# Altium schematic sheet projectthermodigi.SchDoc
size A4; SheetNumber: 1; SheetTotal: 2
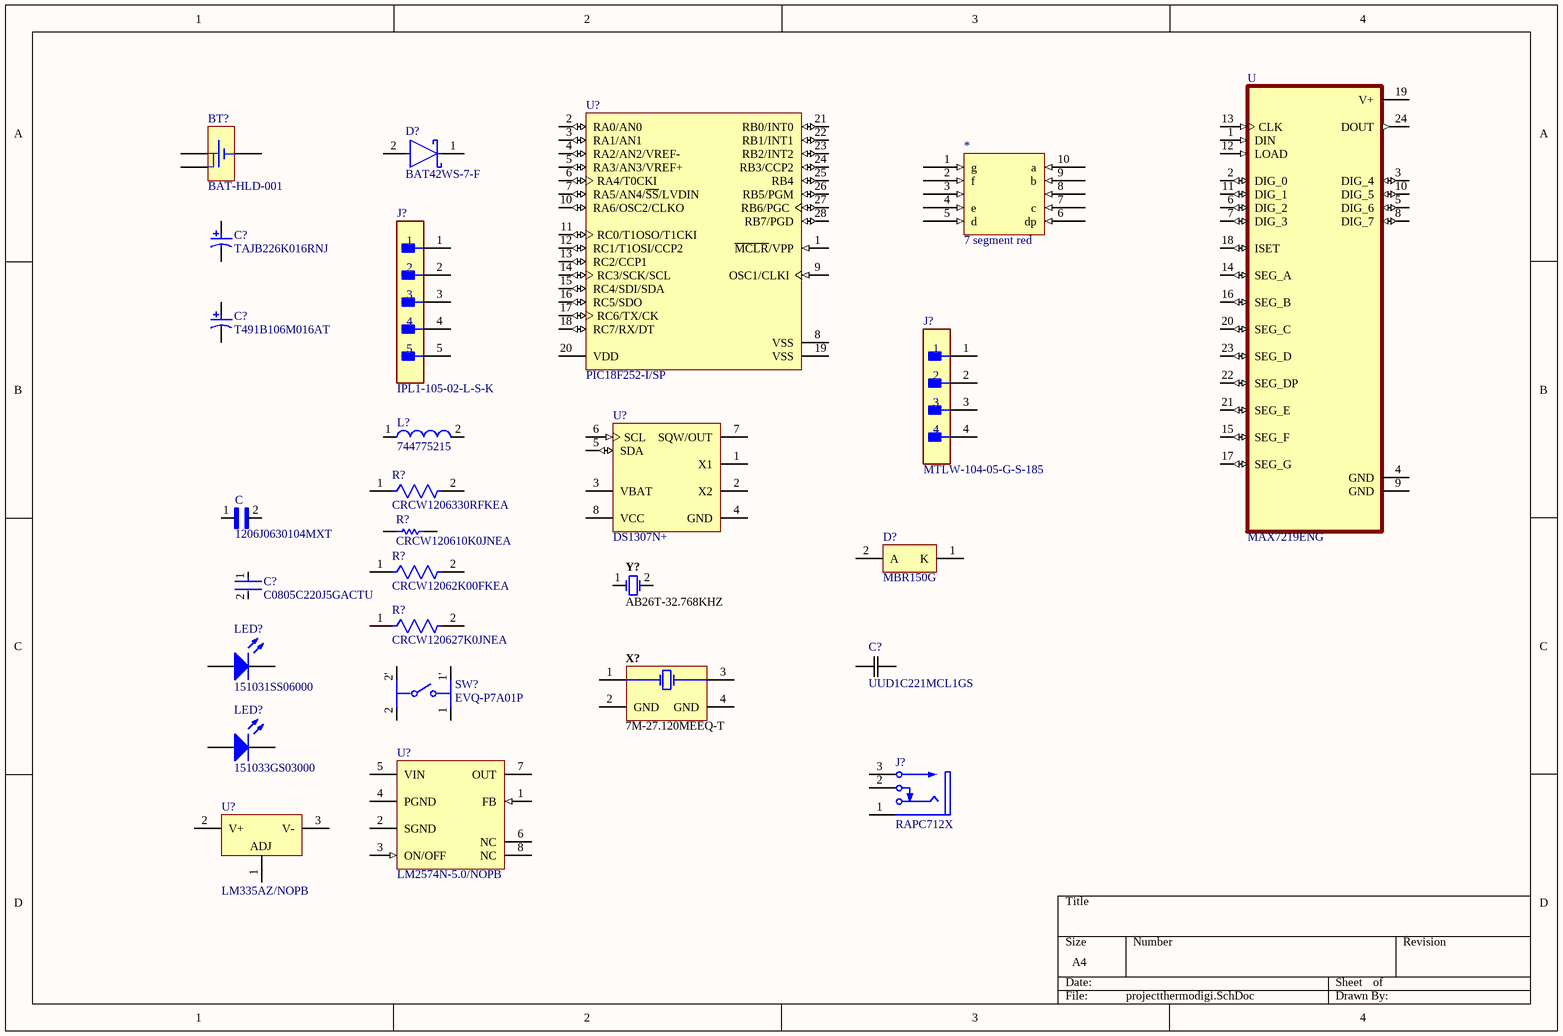
[diagram p0: projectthermodigi.SchDoc]

## Parts
(Parts that share a designator on the sheet are numbered #1, #2 ... from top to bottom, then left to right.)
*  7 segment red  [7 segment]
BT?  BAT-HLD-001  [BATHLD-001]
C  1206J0630104MXT  [CAPC3216X160N]
C?#1  TAJB226K016RNJ  [AVX-TAJ-B-2_M]
C?#2  T491B106M016AT  [KEMT-T491-B_L]
C?#3  C0805C220J5GACTU  [FP-C0805C-DN-MFG]
C?#4  UUD1C221MCL1GS  [U2-K_NCH]
D?#1  BAT42WS-7-F  [FP-SOD323-MFG]
D?#2  MBR150G  [ONSC-AXIAL_LEAD-2-59-10_P]
J?#1  IPL1-105-02-L-S-K  [FP-IPL1-105-02-L-S-K-0]
J?#2  MTLW-104-05-G-S-185  [FP-MTLW-104-05-G-S-185-MFG]
J?#3  RAPC712X  [SWITCH-RAPC712X-3_V]
L?  744775215  [WE-PD2-L]
LED?#1  151031SS06000  [Type 3mm]
LED?#2  151033GS03000  [Type 3mm]
R?#1  CRCW1206330RFKEA  [FP-CRCW1206-e3-IPC_A]
R?#2  CRCW120610K0JNEA  [RESC3216X60X45ML10T20]
R?#3  CRCW12062K00FKEA  [FP-CRCW1206-e3-IPC_A]
R?#4  CRCW120627K0JNEA  [FP-CRCW1206-e3-MFG]
SW?  EVQ-P7A01P  [FP-EVQ-P7A01P-MFG]
U  MAX7219ENG  [DIP794W47P254L3213H457Q24]
U?#1  PIC18F252-I/SP  [MCHP-SPDIP-SP28]
U?#2  DS1307N+  [P8+2]
U?#3  LM2574N-5.0/NOPB  [P0008A]
U?#4  LM335AZ/NOPB  [LP0003A]
X?  7M-27.120MEEQ-T  [TXC-7M-4_V]
Y?  AB26T-32.768KHZ  [ABRA-AB26T]

## Nets

Not connected (* = marked no-connect by the designer): * 1(g) 2(f) 3 4(e) 5(d) 6(dp) 7(c) 8 9(b) 10(a); BT? 1(-) 2(+) 3(+); C 1 2; C?#1 1 2; C?#2 1 2; C?#3 1 2; C?#4 1 2; D?#1 1(C) 2(A); D?#2 1(K) 2(A); J?#1 1 2 3 4 5; J?#2 1 2 3 4; J?#3 1 2 3; L? 1 2; LED?#1 1(K) 2(A); LED?#2 1(K) 2(A); R?#1 1 2; R?#2 1 2; R?#3 1 2; R?#4 1 2; SW? 1 1' 2 2'; U 1(DIN) 2(DIG_0) 3(DIG_4) 4(GND) 5(DIG_6) 6(DIG_2) 7(DIG_3) 8(DIG_7) 9(GND) 10(DIG_5) 11(DIG_1) 12(LOAD) 13(CLK) 14(SEG_A) 15(SEG_F) 16(SEG_B) 17(SEG_G) 18(ISET) 19(V+) 20(SEG_C) 21(SEG_E) 22(SEG_DP) 23(SEG_D) 24(DOUT); U?#1 1(~{MCLR}/VPP) 2(RA0/AN0) 3(RA1/AN1) 4(RA2/AN2/VREF-) 5(RA3/AN3/VREF+) 6(RA4/T0CKI) 7(RA5/AN4/~{SS}/LVDIN) 8(VSS) 9(OSC1/CLKI) 10(RA6/OSC2/CLKO) 11(RC0/T1OSO/T1CKI) 12(RC1/T1OSI/CCP2) 13(RC2/CCP1) 14(RC3/SCK/SCL) 15(RC4/SDI/SDA) 16(RC5/SDO) 17(RC6/TX/CK) 18(RC7/RX/DT) 19(VSS) 20(VDD) 21(RB0/INT0) 22(RB1/INT1) 23(RB2/INT2) 24(RB3/CCP2) 25(RB4) 26(RB5/PGM) 27(RB6/PGC) 28(RB7/PGD); U?#2 1(X1) 2(X2) 3(VBAT) 4(GND) 5(SDA) 6(SCL) 7(SQW/OUT) 8(VCC); U?#3 1(FB) 2(SGND) 3(ON/OFF) 4(PGND) 5(VIN) 6(NC) 7(OUT) 8(NC); U?#4 1(ADJ) 2(V+) 3(V-); X? 1(X1) 2(GND) 3(X2) 4(GND); Y? 1 2

## Library data of the parts
BT? = CMP-0168-00043-1: 20mm Coin Cell Battery Holder; PCB_Layout: Complies with manufacturer's recommendation.; DatasheetVersion: rev1.0, Dec-2007; PackageVersion: rev1.0, Dec-2007; PackageReference: BATHLD-001; PackageDescription: Low Profile SM Battery Holder, 20mm Lithium Cell, 21.1 x 15.3 x 4.2 mm Body
C = 1206J0630104MXT: 0.1ÂµF Â±20% 63V Ceramic Capacitor X7R (2R1) 1206 (3216 Metric); MF: Knowles Syfer; MP: 1206J0630104MXT; SnapEDA_Link: https://www.snapeda.com/parts/1206J0630104MXT/Knowles%20Syfer/view-part/4314687/?ref=snap; DigiKey-Purchase-URL: https://snapeda.com/shop?store=DigiKey&id=4314687; Mouser-Purchase-URL: https://snapeda.com/shop?store=Mouser&id=4314687; Value: *; Digi-Key_Part_Number: 1608-1392-1-ND; Package: 3216 Knowles Syfer
C?#1 = CMP-2100-03689-1: Standard Tantalum, 22 uF, +/- 10%, 16 V, -55 to 125 degC, 2-Pin SMD (1210), RoHS, Tape and Reel; Manufacturer: AVX; Leakage Current: 3.5uA; Dissipation Factor: 6%; Voltage Rating (DC): 16V; Capacitance: 22uF; ESR (Equivalent Series Resistance): 2.3Ohm; Polarity: Polar; Package Quantity: 1; Tolerance: 10%; Number of Pins: 2; Manufacturer URL: http://www.avx.com/; Height - Seated (Max): 0.083inch; Case Code (Imperial): 1210; Package Reference: TAJ-B-2; Height: 1.9mm; Depth: 2.8mm; Packaging: TapeandReel; Termination: SMD/SMT; Case/Package: 1210; Lead Free: LeadFree; Min Operating Temperature: -55degC; RoHSCompliant: True; Dielectric Material: Tantalum; Case Code (Metric): 3528; Width: 2.8mm; Datasheet URL: http://datasheets.avx.com/TAJ.pdf; Radiation Hardening: No; Package Description: 2-Pin Surface Mount Device, Body 3.5 x 2.85 mm; Length: 3.5mm; Voltage Rating: 16V; Datasheet Version: 42401.0; Max Operating Temperature: 125degC; REACH SVHC: NoSVHC; Voltage: 16V
C?#2 = CMP-2000-07192-1: Tantalum Surface Mount Capacitor, 10 uF, +/- 20%, 16 V, -55 to 125 degC, 2-Pin SMD, RoHS, Tape and Reel; Manufacturer: Kemet; DF: 6%; Product Diameter (mm): NotRequiredmm; ESR: 2.8ohm; Capacitance: 10000000pF; Insulation: NotRequired; Rad Hardened: No; Polarity: Polar; Case Style: Molded; Product Depth (mm): 2.8mm; Product Length (mm): 3.5mm; Voltage: 16VDC; DCL: 1.6uA; Product Height (mm): 1.9mm; Mounting Technology: SurfaceMount; Package Reference: T491-B; Datasheet URL: http://www.kemet.com/Lists/ProductCatalog/Attachments/254/KEM_T2005_T491.pdf; Construction: SMTChip; Package / Case: 3528-21; Length W/Weld: NotRequiredmm; Seated Plane Height: NotRequiredmm; Datasheet Version: 06/2016; Seal: NotRequired; Mounting Style: SurfaceMount; Failure Rate: NotRequired; Operating Temp Range: -55Cto125C; Manufacturer URL: http://www.kemet.com/; Tolerance (+ or -): 20%; Case Code: B; Packaging: TapeandReel; Lead Spacing (nom): NotRequiredmm; Length W/Weld (max): NotRequiredmm; Package Description: 2-Pin Surface Mount Device, Body 3.5 x 2.8 mm; Wire Form: NotRequired
C?#3 = CMP-2007-00048-2: Capacitor; Ceramic; Cap; 22.0pF; Tol 5%; SMT; Vol-Rtg 50V; C0G; Tape and Reel; Manufacturer: KEMET; Temperature Coefficient: 30ppm/°C; Capacitance: 22 pF; Value: 22 pF; Tolerance: 0.05; Device Class L1: Passive Components; Mouser Description: Multilayer Ceramic Capacitors MLCC - SMD/SMT 50volts 22pF C0G 5%; Temperature Range Low: -55°C; Automotive: No; Voltage Rating: 50 V; Material: Ceramic; Category: Cap; Height: 0.88mm; Temperature Range High: +125°C; Digikey Description: Capacitor; Ceramic; Cap; 22.0pF; Tol 5%; SMT; Vol-Rtg 50V; C0G; Tape and Reel; Octopart: https://octopart.com/c0805c220j5gactu-kemet-145470; ComponentLink2Description: Datasheet; Device Class L2: Capacitors; Ipc Land Pattern Name: CAPC200125X78; RoHS: TRUE; ComponentLink2URL: https://content.kemet.com/datasheets/KEM_C1003_C0G_SMD.pdf; Temperature: -55°C to +125°C; Device Class L3: Ceramic Capacitors; Lead Free: Yes; Manufacturer Part Number: C0805C220J5GACTU; Temperature Characteristic: C0G; Package: C0805C-DN
C?#4 = UUD1C221MCL1GS: No Description Available; Vendor: Nichicon; Built_By: EMA_UL_Team; SourceLibrary: Nichicon_2014-12-31; Type: DEV; Manufacturer_Part_Number: UUD1C221MCL1GS; Copyright: Copyright (C) 2018 Accelerated Designs. All rights reserved; RefDes: RefDes
D?#1 = CMP-2000-05925-2: DIODE SCHOTTKY 30V 200MA SOD323; Manufacturer: Diodes Inc.; Max Junction Temp: +125°C; Peak Reverse Current: 0.5uA; Max Surge Forward Current: 4A; Standoff Height: 0.05mm; Capacitance: 10pF; Value: 10pF; Package: SOD323; Max Repetitive Reverse Voltage: 30V; Digikey Description: DIODE SCHOTTKY 30V 200MA SOD323; Forward Current: 200mA; Lead Free: Yes; Device Class L1: Discrete Semiconductors; Height: 1.2mm; Mouser Description: Schottky Diodes & Rectifiers 30V 200mW; Footprint Url: https://www.diodes.com/assets/Package-Files/SOD323.pdf; Automotive: No; Device Class L3: Schottky Diodes; Temperature: -55°C to +125°C; ComponentLink2Description: Datasheet; Temperature Range High: +125°C; Manufacturer Part Number: BAT42WS-7-F; ComponentLink2URL: https://www.diodes.com/assets/Datasheets/ds30100.pdf; Reverse Voltage: 30V; Octopart: https://octopart.com/bat42ws-7-f-diodes+inc.-326107; Temperature Range Low: -55°C; Category: Diode; RoHS: TRUE; Device Class L2: Diodes
D?#2 = CMP-1055-00044-1: Rectifier, 2-Pin Axial_Lead, Pb-Free, Bulk Bag; Manufacturer: On Semiconductor; IFSM Max (A): 25; Configuration: Single; PackageVersion: Rev. U, 02/2005; Packing: Bulk Bag; ComponentLink3URL: http://www.onsemi.cn/pub_link/Collateral/59-10.PDF; ComponentLink1Description: Manufacturer URL; ComponentLink3Description: Package Specification; Mounting Technology: Through Hole; ComponentLink2Description: Datasheet; PartNumber: MBR150G; ComponentLink1URL: http://www.onsemi.com/; ComponentLink2URL: http://www.onsemi.cn/pub_link/Collateral/MBR150-D.PDF; PackageDescription: 2-Pin, Axial Lead, Diameter 2.35 mm; PackageReference: AXIAL_LEAD-2-59-10; DatasheetVersion: Rev. 8; RoHS: TRUE
J?#1 = CMP-02766-000398-1: 5 Position 1 Row .100" (2.54 mm) pitch connector; Number of Positions: 5; Max Current Rating: 7.4A; Pitch: 2.54mm; Connector Type: Male Pin; Max Voltage Rating (AC): 675V; Number of Ports: 1; Gender: Male; Termination: Solder; Min Operating Temperature: -55°C; Max Operating Temperature: 125°C; Mount: Surface Mount; Contact Material: Bronze; Housing Material: Polymer; Depth: 7.04mm; Color: Natural; REACH SVHC: No SVHC; Radiation Hardening: No; Orientation: Straight; Fastening Type: Ramp; Contact Mating Length: 0.215inch; Number of Terminals/Pins: 5; Number of Rows: 1; Packaging: Rail/Tube; Contact Plating: Gold; Length: 14.22mm; Number of Contacts: 5; Lead Free: Lead Free
J?#2 = CMP-02766-000562-1: CONN HEADER VERT 4POS 2.54MM; Number of Contacts: 4; Contact Resistance: 15mR; Connector Type: Male Pin; Gender: Male; Contact Material: Brass; Height: 6.4mm; Contact Mating Length: 0.185inch; Length: 29.64mm; Number of Positions: 4; Packaging: Rail/Tube; Mount: Through Hole; Depth: 2.48mm; Number of Rows: 1; Radiation Hardening: No; Housing Material: Polymer; Pitch: 2.54mm; Max Operating Temperature: 105°C; Termination: Solder; Min Operating Temperature: -40°C; Color: Black; Orientation: Straight; Housing Color: Black; Contact Plating: Gold
J?#3 = CMP-2000-05383-1: Conn Powerjack Mini R/A PCMT, 5 A, 3-Pin THD, RoHS; Manufacturer: Switchcraft; Gender: Male; Current Rating: 5A; Connector Type: Jack; Dynamic Catalog: SwitchcraftInc; Other Names: Q2387461 / Q2526383 / RAPC712X-ND / SC237; Internal Switch(s): SingleSwitch,NormallyClosed; Catalog Drawings: RAPC7(1,2)2XSide / RAPC7(1,2)2XTop; Plug/Mating Plug Diameter: 2.5mmID,5.5mmOD; Number of Positions/Contacts: 2Conductors,2Contacts; Shielding: Unshielded; Mating Products: SC1539-ND / -CONNPLUGMINIPWR2CONDBLK/RED / SC1051-ND / -CONNPLUGMINIPOWER2CONDBLACK; Mounting Type: ThroughHole,RightAngle; Manufacturer URL: http://www.switchcraft.com/; Contact Material: Brass; Standard Package: 2,500; RoHS Information: SwitchcraftRoHSInfo; Termination: SolderEyelet(s); Housing Color: Black; Datasheet Version: Rev. A, 08/2005; Family: Barrel-PowerConnectors; Housing Material: Thermoplastic; Color: Black; Datasheet URL: https://datasheet.ciiva.com/391/rapc712x-cd-391666.pdf; Category: Connectors,Interconnects; Contact Material - Plating: Nickel
L? = CMP-0227-00470-1: SMD Power Inductor WE-PD2, L = 150 µH; Inductance: 150 ÂµH; ComponentLink1Description: Manufacturer Link; ComponentLink2Description: Datasheet; DatasheetVersion: ver 1, Oct-2004; ComponentLink1URL: http://www.we-online.com; PackageDescription: SMD Inductor, 2-Leads, Body 7.8 x 7.0 mm; PackageVersion: 2004; PackageReference: WE-PD2-L; ComponentLink2URL: http://www.we-online.de/katalog/media/pdf/744775215.pdf
LED?#1 = CMP-1488-00002-1: THT LED round mono-color color lens, WL-TMRW, Super Red; Manufacturer: Wuerth Elektronik; ComponentLink2URL: http://katalog.we-online.de/pbs/datasheet/7448042001.pdfhttp://katalog.we-online.de/pbs/datasheet/7448042001.pdfhttp://katalog.we-online.de/pbs/datasheet/7448042001.pdfhttp://katalog.we-online.de/pbs/datasheet/151031SS06000.pdf; ComponentLink1URL: http://www.we-online.com; PartNumber: 151031SS06000; ComponentLink2Description: Datasheet; PackageReference: Type 3mm; Emitting color: Super Red; ComponentLink1Description: Manufacturer URL
LED?#2 = CMP-1489-00001-1: THT LED round mono-color waterclear, THT WL-TMRW ,Green; Manufacturer: Wuerth Elektronik; ComponentLink2URL: http://katalog.we-online.de/pbs/datasheet/7448042001.pdfhttp://katalog.we-online.de/pbs/datasheet/7448042001.pdfhttp://katalog.we-online.de/pbs/datasheet/7448042001.pdfhttp://katalog.we-online.de/pbs/datasheet/151033GS03000.pdf; ComponentLink2Description: Datasheet; Emitting color: Green; ComponentLink1Description: Manufacturer URL; PackageReference: Type 3mm; PartNumber: 151033GS03000; ComponentLink1URL: http://www.we-online.com
R?#1 = CMP-2003-02098-2: RES Thick Film, 330Ω, 1%, 0.25W, 100ppm/°C, 1206; Voltage Rating: 200V; Resistance: 330R; Max Power Dissipation: 250mW; Height: 0.55mm; Mount: Surface Mount; Min Operating Temperature: -55°C; Depth: 1.6mm; Features: Automotive AEC-Q200; Voltage Rating (DC): 200V; Military Standard: Not; Packaging: Tape and Reel; Composition: Thick Film; Contact Plating: Tin; Case Code (Imperial): 1206; Case/Package: 1206; Number of Terminations: 2; Length: 3.2mm; Lead Free: Lead Free; Tolerance: 1%; Temperature Coefficient: 100ppm/°C; Case Code (Metric): 3216; Width: 1.6mm; Weight: 0.000353oz; Termination: SMD/SMT; Radiation Hardening: No; Package Quantity: 10; Power Rating: 250mW; Max Operating Temperature: 155°C
R?#2 = CMP-2003-04808-1: Manufacturer: Vishay Dale; Part Number: CRCW120610K0JNEA
R?#3 = CMP-1014-00542-3: RES Thick Film, 2kΩ, 1%, 0.25W, 100ppm/°C, 1206; Max Power Dissipation: 250mW; Voltage Rating: 200V; Resistance: 2kR; Package Quantity: 10; Height: 0.55mm; Tolerance: 1%; Number of Terminations: 2; Mount: Surface Mount; Width: 1.6mm; Length: 3.2mm; Features: Automotive AEC-Q200; Contact Plating: Tin; Number of Pins: 2; Weight: 0.000353oz; Max Operating Temperature: 155°C; Min Operating Temperature: -55°C; Termination: SMD/SMT; Temperature Coefficient: 100ppm/°C; Case Code (Imperial): 1206; Depth: 1.6mm; Military Standard: Not; Case Code (Metric): 3216; Composition: Thick Film; Power Rating: 250mW; Case/Package: 1206; Radiation Hardening: No; Packaging: Tape and Reel
R?#4 = CMP-1014-00108-3: RES Thick Film, 27kΩ, 5%, 0.25W, 200ppm/°C, 1206; Power Rating: 250mW; Voltage Rating: 200V; Resistance: 27kR; Packaging: Tape and Reel; Number of Terminations: 2; Case Code (Metric): 3216; Temperature Coefficient: 200ppm/°C; Width: 1.6mm; Depth: 1.6mm; Height: 0.024inch; Min Operating Temperature: -55°C; Composition: Thick Film; Length: 3.2mm; Lead Free: Lead Free; Features: Automotive AEC-Q200; Case Code (Imperial): 1206; Radiation Hardening: No; Contact Plating: Tin; Case/Package: 1206; Weight: 0.000353oz; Military Standard: Not; Max Operating Temperature: 155°C; Voltage Rating (DC): 200V; Termination: SMD/SMT; Number of Pins: 2; Package Quantity: 1; Max Power Dissipation: 250mW; Tolerance: 5%
SW? = CMP-05618-000007-1: SWITCH TACTILE SPST-NO 0.05A 12V; Manufacturer: Panasonic; Operating Force: 2.2N; Contact Resistance: 500mΩ; Contact Current Rating: 50mA; Electromechanical Life: 100000Cycles; Device Class L2: Switches; Lead Free: Yes; Mount: Surface Mount; Digikey Description: SWITCH TACTILE SPST-NO 0.05A 12V; Temperature Range High: +70°C; Device Class L3: Tactile Switches; Package: EVQ-P7A01P; Voltage Rating Dc: 12V; Octopart: https://octopart.com/evq-p7a01p-panasonic-29917075; ComponentLink2URL: https://industrial.panasonic.com/cdbs/www-data/pdf/ATK0000/ATK0000C378.pdf; Automotive: No; Device Class L1: Electromechanical; Mouser Description: SWITCH TACTILE SPST-NO 0.05A 12V; Temperature: -20°C to +70°C; Manufacturer Part Number: EVQ-P7A01P; ComponentLink2Description: Datasheet; RoHS: TRUE; Category: Switch; Temperature Range Low: -20°C; Throw Configuration: SPST-NO; Height: 1.55mm
U = MAX7219ENG: IC DRVR 7 SEGMENT 8 DIGIT 24DIP; MF: Maxim Integrated; Price: None; Package: DIP-24 Maxim Integrated; Value: *; MP: MAX7219ENG; Availability: Unavailable; SnapEDA_Link: https://www.snapeda.com/parts/MAX7219ENG/Maxim%20Integrated/view-part/1189180/?ref=snap
U?#1 = CMP-0116-01650-1: High Performance, Enhanced Flash Microcontroller with 10-Bit A/D, 40 MHz, 23 I/O, -40 to 85 degC, 28-pin SPDIP (SP28), Tube; Manufacturer: Microchip; # of A/D Channels: 5; Program Memory KBytes: 32; Operation Voltage Range: 4.2V - 5.5V; Program Memory KWords: 16; RAM: 1536; Timers: 1 - 8-bit, 3 - 16-bit; EEPROM Data Memory (bytes): 256; Max. CPU Speed MHz: 40; I/O Pins: 23; Digital Communication: 0 -UART, 1 -A/E/USART, 0 -SPI, 0 -I2C, 1 -MSSP(SPI/I2C); ComponentLink3URL: Product URL:http://www.microchip.com/datasheet/PIC18F252; PackageReference: SPDIP-SP28; RoHS: TRUE; ComponentLink1URL: http://ww1.microchip.com/downloads/en/DeviceDoc/39564c.pdf; PackageDescription: 28-Lead Plastic Dual In-Line, 34.86 x 6.79 mm Body, 2.54 mm Pitch; PartNumber: PIC18F252-I/SP; ComponentLink1Description: Datasheet; Memory Type: Flash; Packing: TUBE; ComponentLink2URL: http://www.microchip.com/stellent/groups/techpub_sg/documents/packagingspec/en012702.pdf; DatasheetVersion: Rev. C; ComponentLink2Description: Package Specification; ComponentLink3Description: URL Link1; Mounting Technology: Through Hole; PackageVersion: C04-070B, 12/2012
U?#2 = CMP-0254-00153-1: 64 x 8, Serial, I2C Real-Time Clock, 5.0V, 8-Pin PDIP, -40 to 85 degC, Pb-Free; ComponentLink1Description: Manufacturer URL; ComponentLink2Description: Datasheet; DatasheetVersion: 10-Feb-2008; PackageDescription: 8-Pin Plastic Dual-In-Line, Narrow (0.3in), Pitch 2.54 mm, PDIP(N), Pb-Free; ComponentLink3URL: http://pdfserv.maxim-ic.com/package_dwgs/21-0043.PDF; PackageReference: P8+2; PackageVersion: revE, 2011; ComponentLink3Description: Package Specification; Code_JEDEC: MS-001-AB; ComponentLink1URL: http://www.maxim-ic.com; ComponentLink2URL: http://datasheets.maxim-ic.com/en/ds/DS1307.pdf
U?#3 = CMP-0069-00461-3: SIMPLE SWITCHER® 0.5A Step-Down Voltage Regulator, 8-pin MDIP, Pb-Free; Manufacturer: Texas Instruments; PowerWise: N; PackageTopMarking: NSUZXYTTE#*LM2574N*-5.0 P+; PinCount: 8; ComponentLink1URL: http://www.ti.com/general/docs/lit/getliterature.tsp?genericPartNumber=LM2574&fileType=pdf; CompType: Switcher; Code_JEDEC: MS-001-BA; ComponentLink1Description: Datasheet URL; RoHS: Y; PackageDescription: MDIP, .365 x .250 x .130in, 8 Lead, .100in Pitch; PackageReference: P0008A
U?#4 = CMP-0066-00017-3: Precision Temperature Sensor, 3-pin TO-92, Pb-Free; Manufacturer: Texas Instruments; PowerWise: N; CompType: Temp Sensor IC; PackageTopMarking: NSXYTT*LM335*AZ; PinCount: 3; ComponentLink1URL: http://www.ti.com/general/docs/lit/getliterature.tsp?genericPartNumber=LM335&fileType=pdf; Code_JEDEC: TO-226-AA; RoHS: Y; ComponentLink1Description: Datasheet URL; PackageReference: LP0003A; PackageDescription: TO-92, Molded, 3 Lead
X? = CMP-2000-05695-1: Seam Crystal, 7M Series, 3 pF, -40 to 85 degC, 4-Pin SMD, RoHS, Tape and Reel; Manufacturer: TXC; ESR (Equivalent Series Resistance): 60Ohm; Operating Mode: Fundamental; Frequency Stability: ±10ppm; Other Names: 887-1329-1; Catalog Drawings: 7MSeriesTop / 7MSeriesBottom / 7MSeriesSide / 7MSeriesCircuit; Frequency: 27.12MHz; Load Capacitance: 10pF; Mounting Technology: SurfaceMount; Type: MHzCrystal; Height: 0.031"(0.80mm); Mounting Type: SurfaceMount; Series: 7M; Package Reference: 7M-4; Size / Dimension: 0.126"Lx0.098"W(3.20mmx2.50mm); Package Description: 4-Pin Surface Mount Device, Body 3.2 x 2.5 mm; Datasheet URL: http://datasheet.octopart.com/7M-27.120MEEQ-T-TXC-datasheet-10979173.pdf; Operating Temperature: -20°C~70°C; Datasheet Version: 02/2010; Family: Crystals; Dynamic Catalog: 7MSeries; Packaging: CutTape(CT); Manufacturer URL: http://www.txccorp.com/; Standard Package: 1; Category: CrystalsandOscillators; Frequency Tolerance: ±10ppm; Package / Case: 4-SMD,NoLead(DFN,LCC)
Y? = CMP-2000-05723-1: Crystal, 12.5 pF, 32.768 KHz, -10 to 60 degC, 2-Pin THD, RoHS, Bulk; Manufacturer: ABRACON; ESR: 35kOhms; Frequency Stability: -0.034PPM; Load Capacitance: 12.5pF; Tolerance: 20PPM; Case Length: 6.2mm; Case Diameter: 2.1mm; RoHS: Details; Product Category: Crystals; Type: WatchCrystal; Manufacturer URL: http://www.abracon.com/; Operating Temperature Range: -10Cto+60C; Package Description: 2-Pin Through Hole Device, Dia 2.1 mm, Body Length 6.2 mm; Termination Style: Radial; Datasheet Version: 06/2010; Datasheet URL: http://www.abracon.com/Resonators/AB26T.pdf; Packaging: Bulk; Factory Pack Quantity: 500; Brand: ABRACON; Mounting Technology: ThroughHole; Package URL: http://www.abracon.com/Support/PackageDrawing/Resonators/AB26T.PDF; Package / Case: Cylinder; Lead Spacing: 0.8mm; Dimensions: 2.1mmDia.x6.2mmL; Mounting Style: ThroughHole; Frequency: 32.768kHz; Package Reference: AB26T; Series: AB26T